# EasyEDA Pro project ProPrj_CraftVia-MakerCard-S-v1-Rev0_2026-09-30.epro, schematic MakerCard-S-Rev0

## Sheets
1 Core-G031: Board Name: Board1; Create Date: 2026-09-03; Page Name: P1; Project Name: CraftVia-Core-S-G031-v1-Rev0; Schematic Name: Schematic1; Update Date: 2026-09-03; Company: EasyEDA.com; Page Size: A3; Version: V1.0
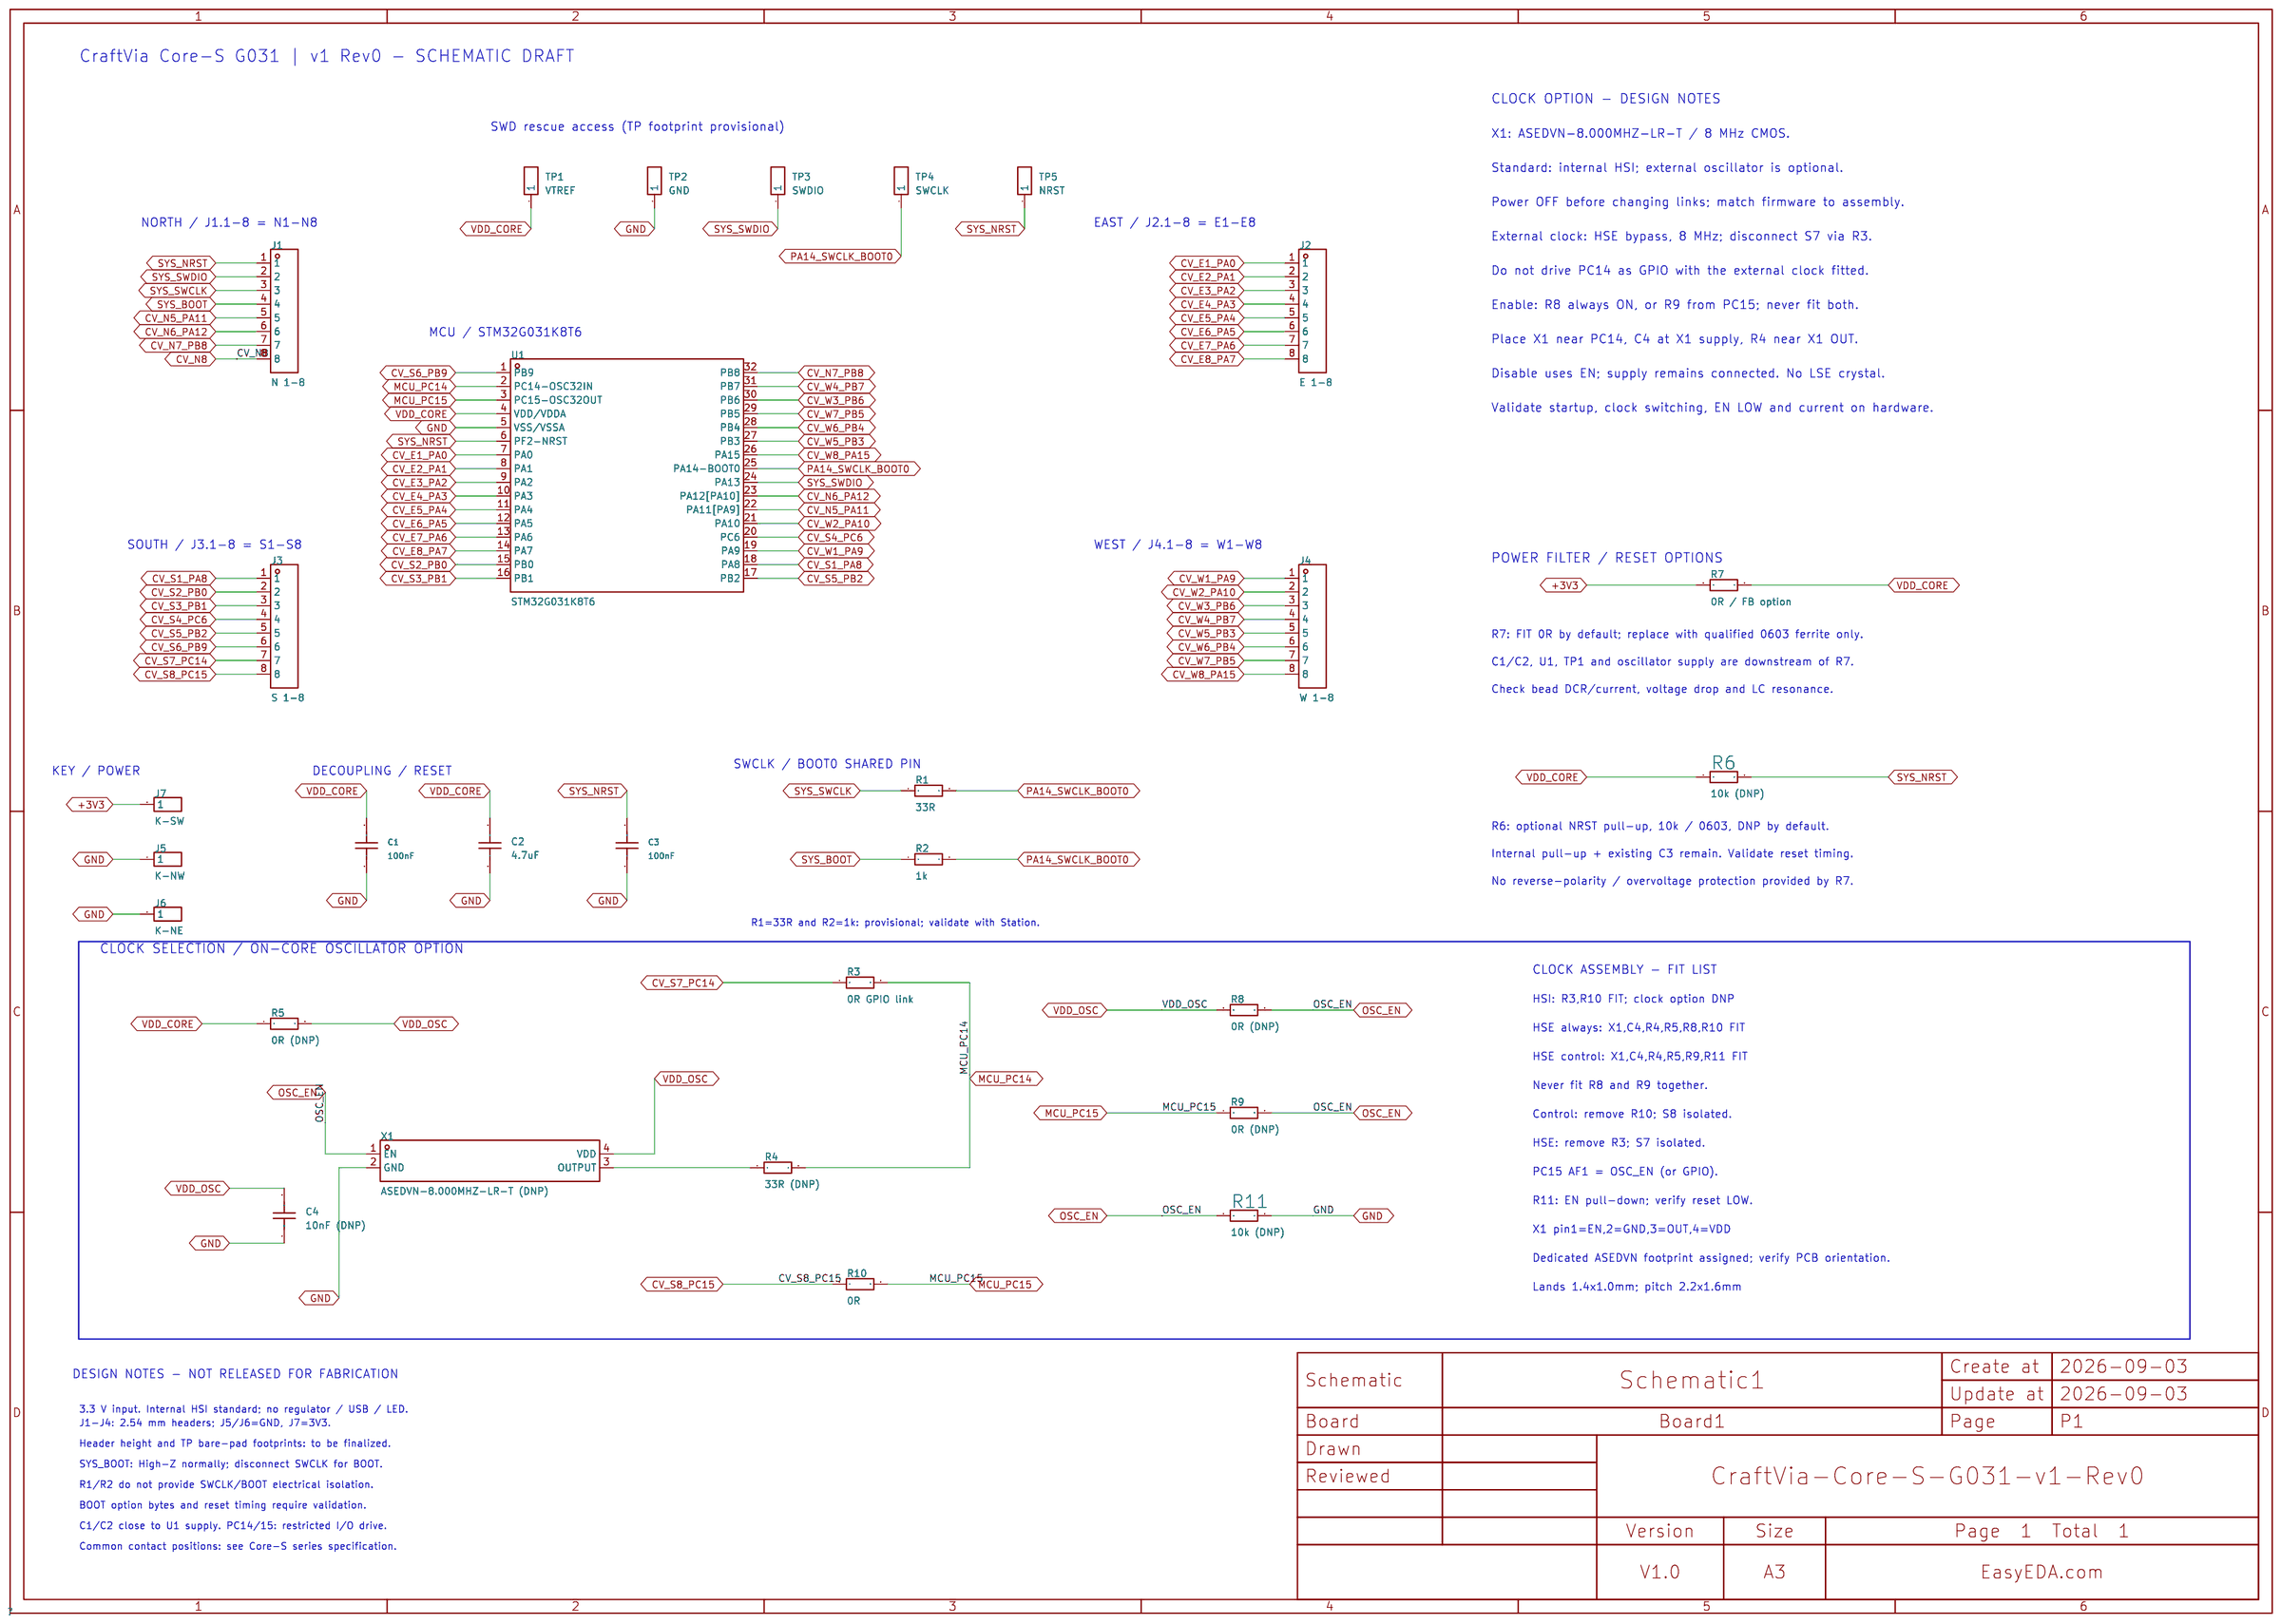
[diagram p0: Core-G031]
2 02_CORE_BREAKOUT: Create Date: 2026-09-22; Project Name: CraftVia-MakerCard-S-v1-Rev0; Schematic Name: MakerCard-S-Rev0; Update Date: 2026-09-22; Page Size: A4
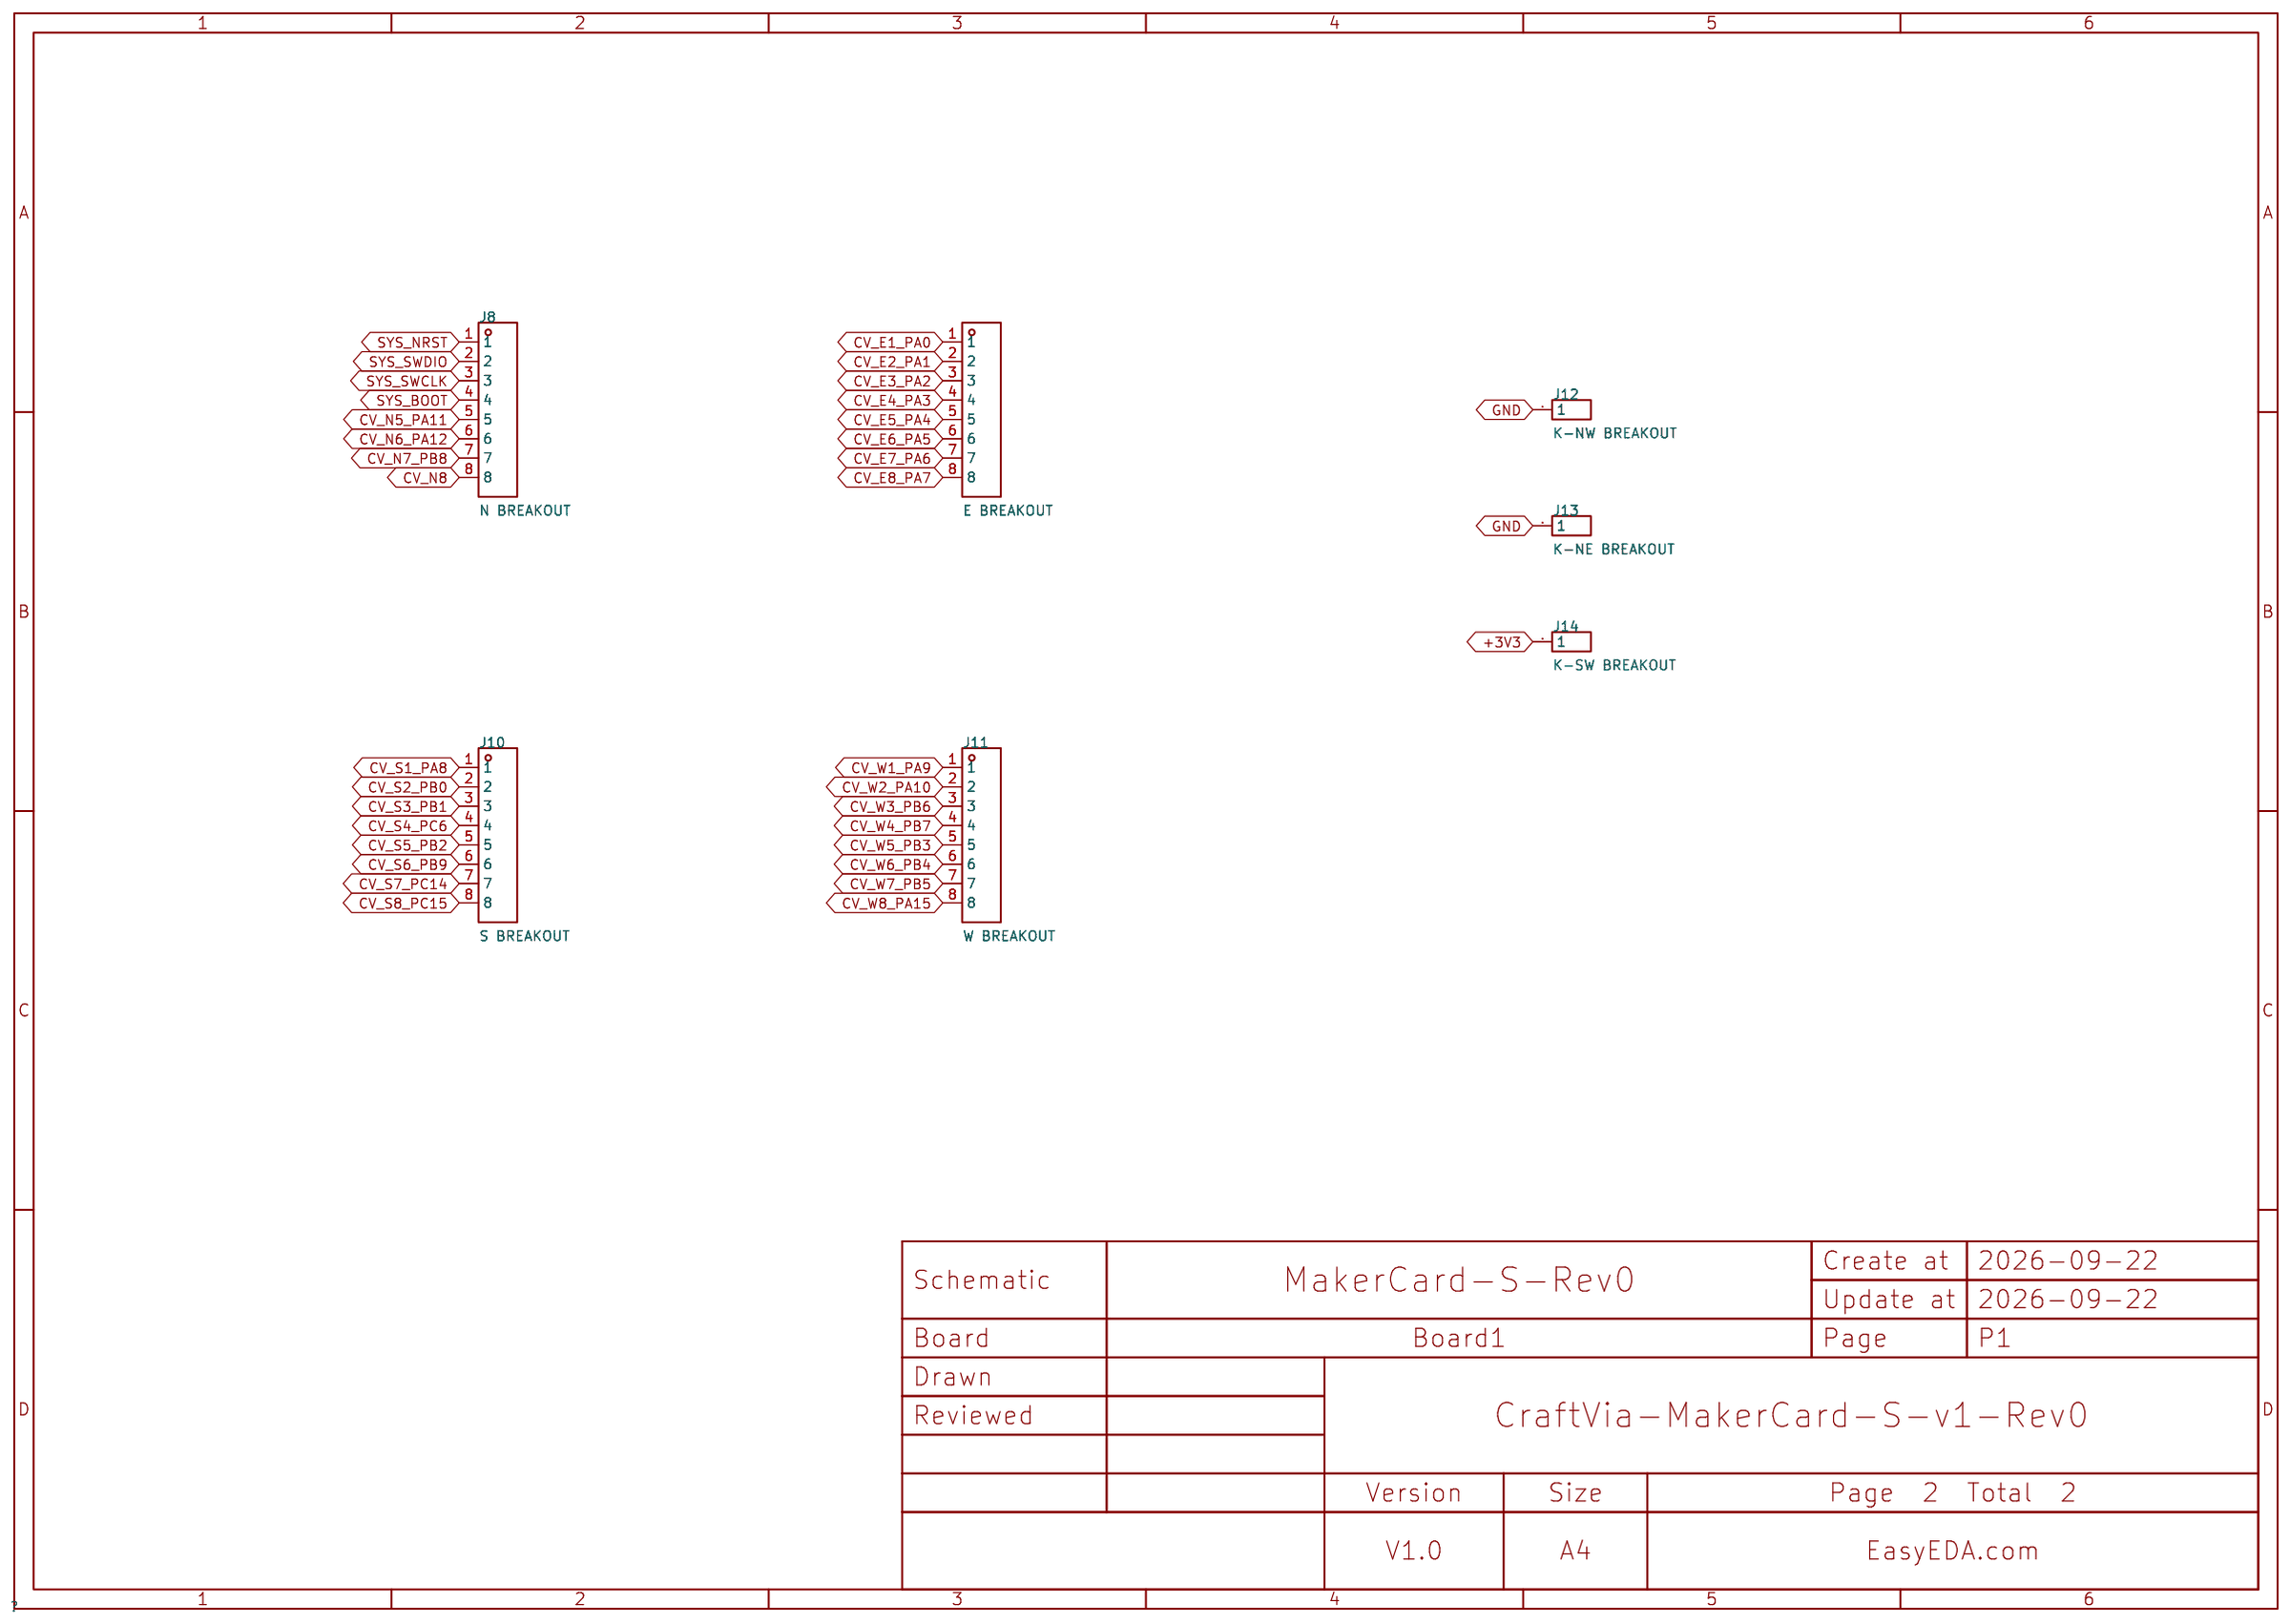
[diagram p1: 02_CORE_BREAKOUT]
3 03_PROTO_AREA: Create Date: 2026-09-22; Project Name: CraftVia-MakerCard-S-v1-Rev0; Schematic Name: MakerCard-S-Rev0; Update Date: 2026-09-22; Page Size: A4
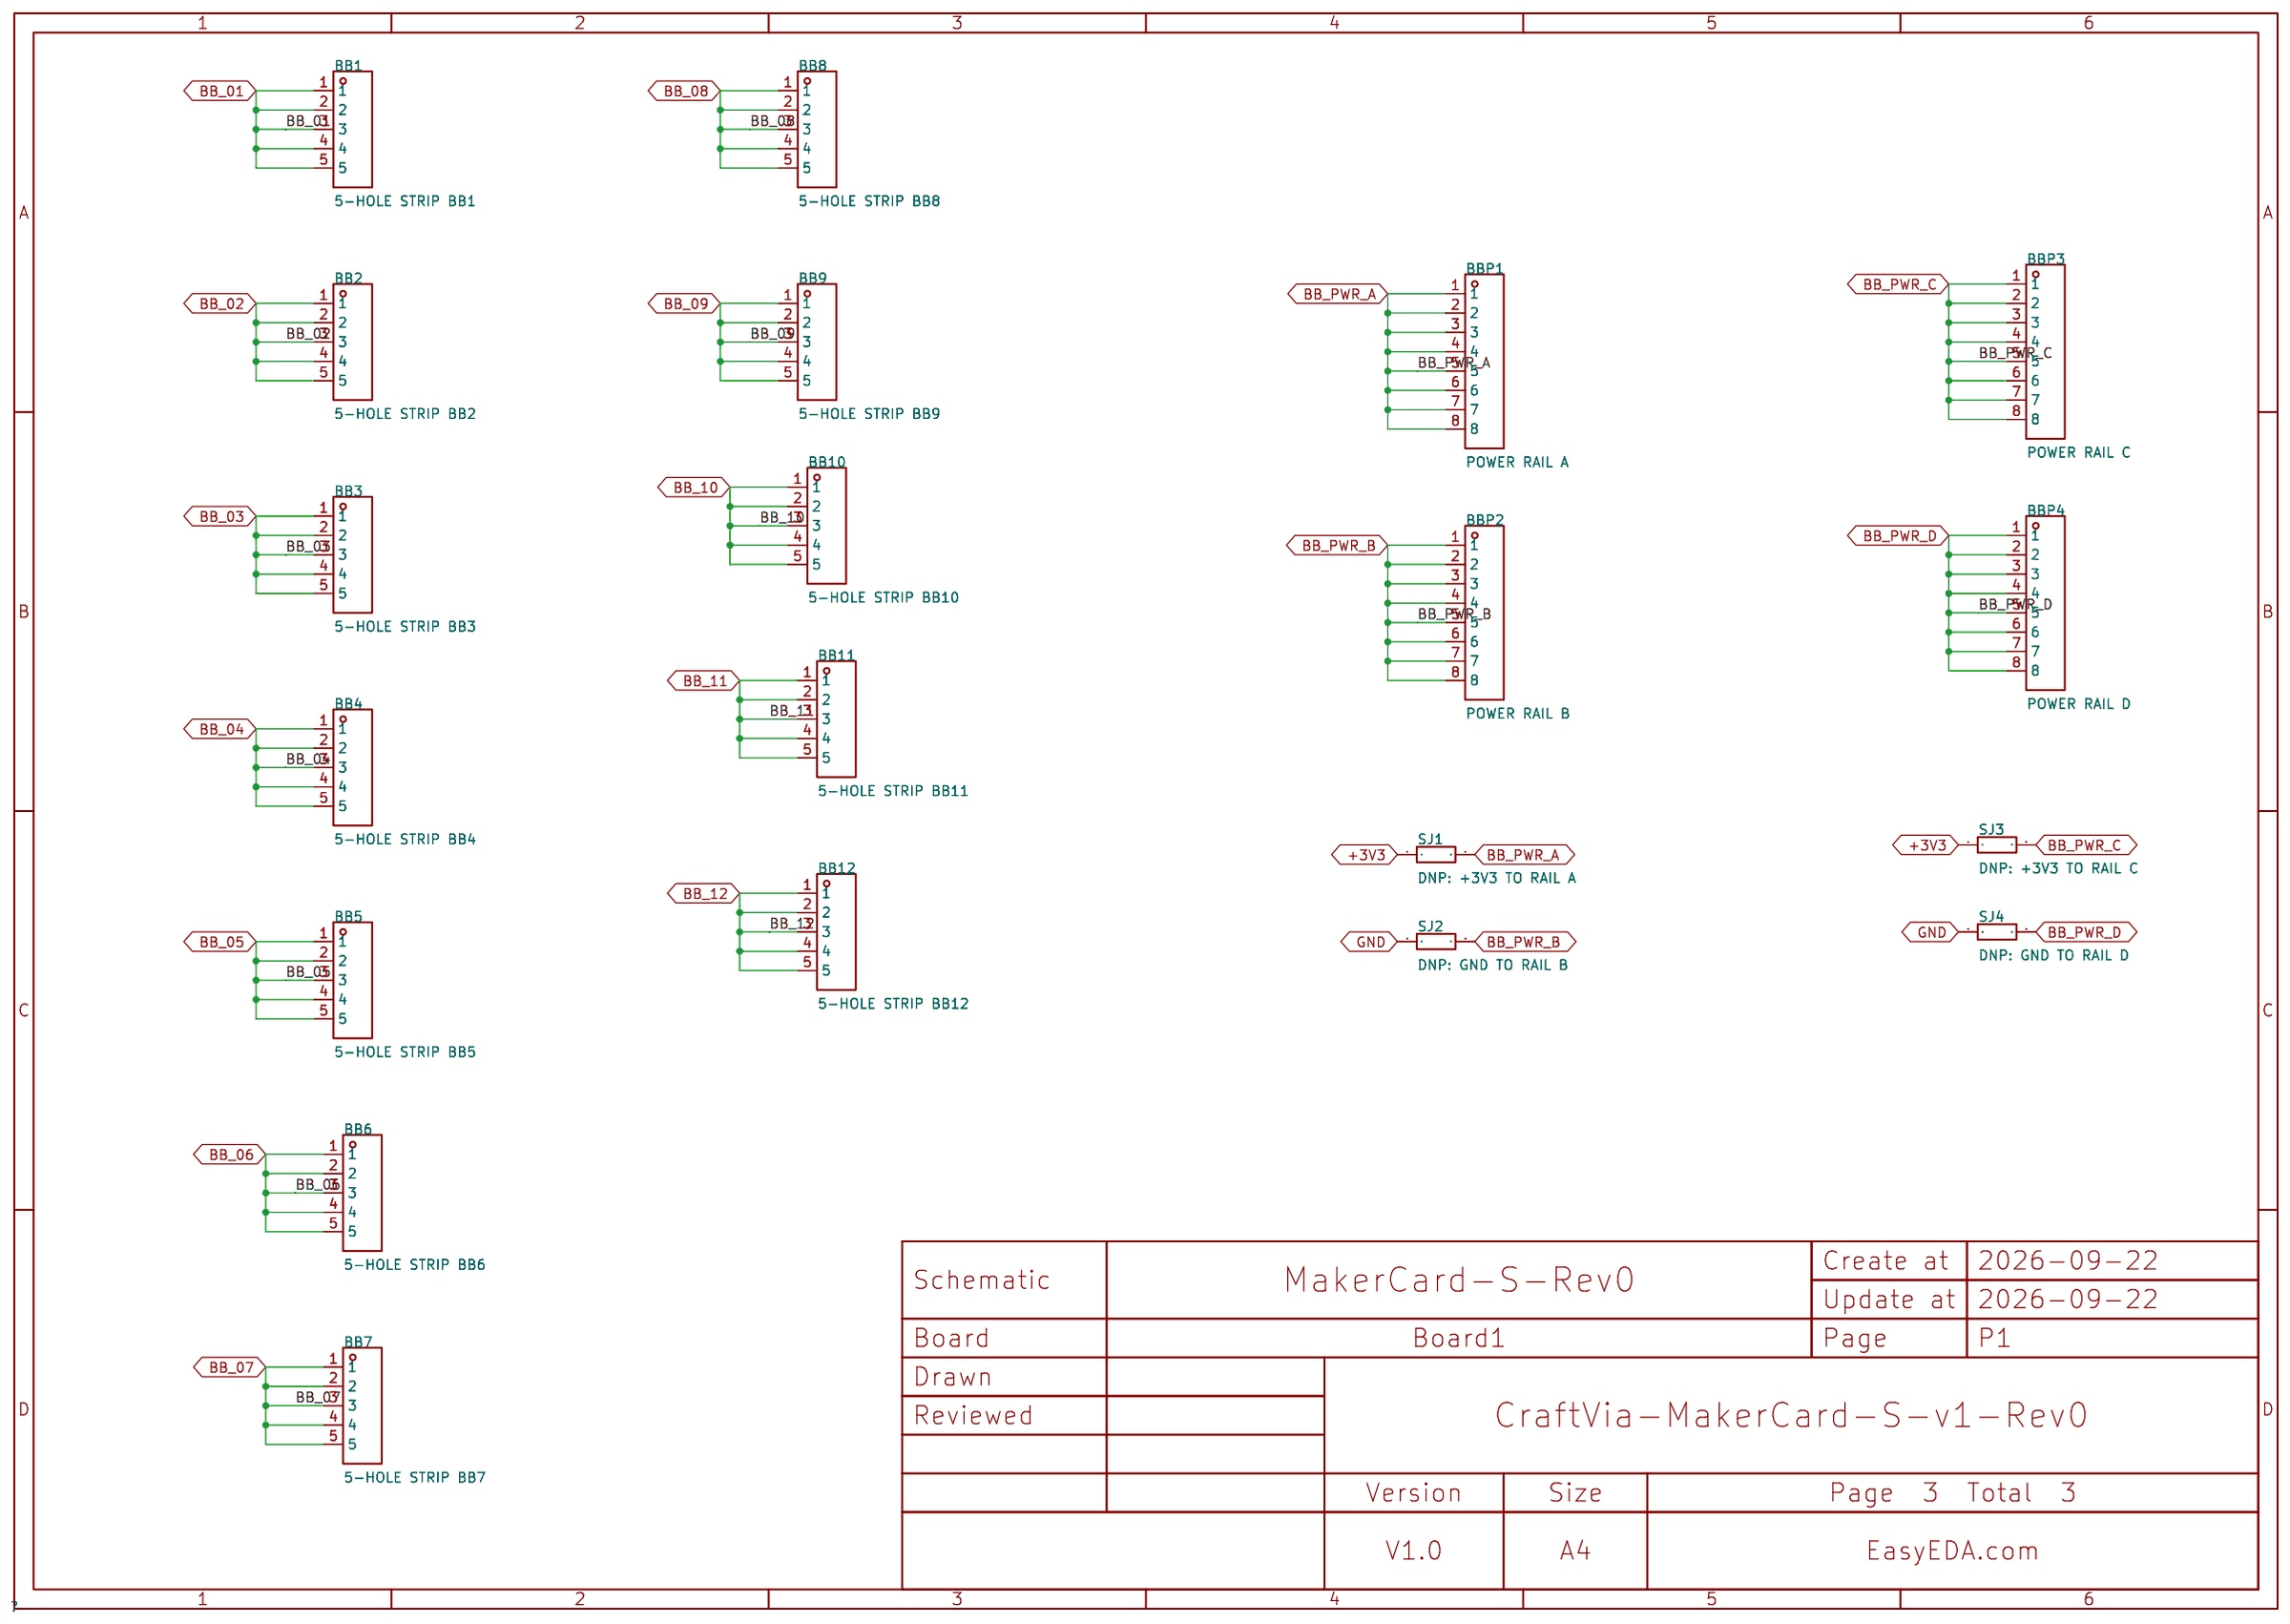
[diagram p2: 03_PROTO_AREA]

## Parts
sheet 02_CORE_BREAKOUT
J8  N BREAKOUT  [HDR-TH_8P-P2.54-V-M]  (no BOM)
J9  E BREAKOUT  [HDR-TH_8P-P2.54-V-M]  (no BOM)
J10  S BREAKOUT  [HDR-TH_8P-P2.54-V-M]  (no BOM)
J11  W BREAKOUT  [HDR-TH_8P-P2.54-V-M]  (no BOM)
J12  K-NW BREAKOUT  [HDR-TH_1P-P2.54-V-M]  (no BOM)
J13  K-NE BREAKOUT  [HDR-TH_1P-P2.54-V-M]  (no BOM)
J14  K-SW BREAKOUT  [HDR-TH_1P-P2.54-V-M]  (no BOM)
sheet 03_PROTO_AREA
BB1  5-HOLE STRIP BB1  [HDR-TH_5P-P2.54-V-M]  (no BOM)
BB2  5-HOLE STRIP BB2  [HDR-TH_5P-P2.54-V-M]  (no BOM)
BB3  5-HOLE STRIP BB3  [HDR-TH_5P-P2.54-V-M]  (no BOM)
BB4  5-HOLE STRIP BB4  [HDR-TH_5P-P2.54-V-M]  (no BOM)
BB5  5-HOLE STRIP BB5  [HDR-TH_5P-P2.54-V-M]  (no BOM)
BB6  5-HOLE STRIP BB6  [HDR-TH_5P-P2.54-V-M]  (no BOM)
BB7  5-HOLE STRIP BB7  [HDR-TH_5P-P2.54-V-M]  (no BOM)
BB8  5-HOLE STRIP BB8  [HDR-TH_5P-P2.54-V-M]  (no BOM)
BB9  5-HOLE STRIP BB9  [HDR-TH_5P-P2.54-V-M]  (no BOM)
BB10  5-HOLE STRIP BB10  [HDR-TH_5P-P2.54-V-M]  (no BOM)
BB11  5-HOLE STRIP BB11  [HDR-TH_5P-P2.54-V-M]  (no BOM)
BB12  5-HOLE STRIP BB12  [HDR-TH_5P-P2.54-V-M]  (no BOM)
BBP1  POWER RAIL A  [HDR-TH_8P-P2.54-V-M]  (no BOM)
BBP2  POWER RAIL B  [HDR-TH_8P-P2.54-V-M]  (no BOM)
BBP3  POWER RAIL C  [HDR-TH_8P-P2.54-V-M]  (no BOM)
BBP4  POWER RAIL D  [HDR-TH_8P-P2.54-V-M]  (no BOM)
SJ1  0Ω  [R0603]  (no BOM)
SJ2  0Ω  [R0603]  (no BOM)
SJ3  0Ω  [R0603]  (no BOM)
SJ4  0Ω  [R0603]  (no BOM)
sheet Core-G031
C1  100nF  [C0603]
C2  4.7uF  [C0603]
C3  100nF  [C0603]
C4  10nF  [C0603]  (no BOM)
J1  N 1-8  [HDR-TH_8P-P2.54-V-M]
J2  E 1-8  [HDR-TH_8P-P2.54-V-M]
J3  S 1-8  [HDR-TH_8P-P2.54-V-M]
J4  W 1-8  [HDR-TH_8P-P2.54-V-M]
J5  K-NW  [HDR-TH_1P-P2.54-V-M]
J6  K-NE  [HDR-TH_1P-P2.54-V-M]
J7  K-SW  [HDR-TH_1P-P2.54-V-M]
R1  33Ω  [R0603]
R2  1kΩ  [R0603]
R3  0Ω  [R0603]
R4  33Ω  [R0603]  (no BOM)
R5  0Ω  [R0603]  (no BOM)
R6  10kΩ  [R0603]  (no BOM)
R7  0Ω  [R0603]
R8  0Ω  [R0603]  (no BOM)
R9  0Ω  [R0603]  (no BOM)
R10  0Ω  [R0603]
R11  10kΩ  [R0603]  (no BOM)
TP1  VTREF  [HDR-TH_1P-P2.54-V-M]  (no BOM)
TP2  GND  [HDR-TH_1P-P2.54-V-M]  (no BOM)
TP3  SWDIO  [HDR-TH_1P-P2.54-V-M]  (no BOM)
TP4  SWCLK  [HDR-TH_1P-P2.54-V-M]  (no BOM)
TP5  NRST  [HDR-TH_1P-P2.54-V-M]  (no BOM)
U1  STM32G031K8T6  [LQFP-32_L7.0-W7.0-P0.80-LS9.0-BL]
X1  8MHz  [CraftVia_ASEDVN_3225_4P]  (no BOM)

## Library data of the parts
J8-J11 = 直排针2.54mm 1*8P: MakerCard-S external 2.54mm breakout; DNP; LCSC Part Name: 直排针 2.54mm 1*8P; Supplier Part: Header2.54mm 1*8P.1; Supplier Footprint: 插件; JLCPCB Part Class: Extended Part; Supplier: LCSC
J12-J14 = 2.54-1*1P针: MakerCard-S external 2.54mm breakout; DNP; LCSC Part Name: 1x1P 方针 直插; Supplier Part: Header-Male-2.54_1x1.1; Manufacturer: BOOMELE(博穆精密); Supplier Footprint: 插件,P=2.54mm; JLCPCB Part Class: Extended Part; Datasheet: https://item.szlcsc.com/datasheet/2.54-1*1P%25E9%2592%2588/82426.html; Supplier: LCSC; Pin Structure: 1x1P; Circluar Pins/Square Pins: Pin Header; Mounting Type: Through Hole; Number of Rows: 1; Number of Pins: 1P; Current Rating: 3A; Length of Mating Pin: 6mm; Insulation Height: 2.5mm; Length of End Connection Pin: 3mm; Contact Material: Brass; Contact Plating: Gold; Operating Temperature: -55℃~+105℃; Color: Black
BB1-BB12 = 2.54mm 1*5P 直排针: MakerCard-S breadboard-style five-hole connected strip; DNP; Supplier Part: 2.54mm 1*5P Header.1; JLCPCB Part Class: Extended Part; Supplier: LCSC
BBP1-BBP4 = 直排针2.54mm 1*8P: MakerCard-S configurable eight-hole breadboard power rail; DNP; LCSC Part Name: 直排针 2.54mm 1*8P; Supplier Part: Header2.54mm 1*8P.1; Supplier Footprint: 插件; JLCPCB Part Class: Extended Part; Supplier: LCSC
SJ1-SJ4 = 0603WAF0000T5E: Optional 0603 solder bridge / 0R link; DNP; LCSC Part Name: 厚膜电阻 0Ω ±1%; Supplier Part: 0603WAF0000T5E.1; Manufacturer: UNI-ROYAL(厚声); Supplier Footprint: 0603; JLCPCB Part Class: Basic Part; Datasheet: https://item.szlcsc.com/datasheet/0603WAF0000T5E/21903.html; Supplier: LCSC; Type: Thick Film Resistor; Tolerance: ±1%; Power(Watts): 100mW; Voltage-Supply(Max): 75V; Operating Temperature: -55℃~+155℃
C1 C3 = CC0603KRX7R9BB104: Capacitance:100nF Tolerance:±10% Tolerance:±10% Voltage Rating:50V Temperature Coefficient:X7R; LCSC Part Name: 100nF ±10% 50V; Supplier Part: C14663; Manufacturer: YAGEO(国巨); Supplier Footprint: 0603; JLCPCB Part Class: Basic Part; Datasheet: https://item.szlcsc.com/datasheet/CC0603KRX7R9BB104/15331.html; Supplier: LCSC; Tolerance: ±10%; Voltage Rating: 50V; Temperature Coefficient: X7R
C2 = CL10A475KO8NNNC: Capacitance:4.7uF Tolerance:±10% Tolerance:±10% Voltage Rating:16V Temperature Coefficient:X5R; LCSC Part Name: 4.7uF ±10% 16V; Supplier Part: C19666; Manufacturer: SAMSUNG(三星); Supplier Footprint: 0603; JLCPCB Part Class: Basic Part; Datasheet: https://item.szlcsc.com/datasheet/CL10A475KO8NNNC/20375.html; Supplier: LCSC; Tolerance: ±10%; Voltage Rating: 16V; Temperature Coefficient: X5R
C4 = 0603B103K500NT: Capacitance:10nF Tolerance:±10% Tolerance:±10% Voltage Rating:50V Temperature Coefficient:X7R; LCSC Part Name: 10nF ±10% 50V; Supplier Part: C57112; Manufacturer: FH(风华); Supplier Footprint: 0603; JLCPCB Part Class: Basic Part; Datasheet: https://item.szlcsc.com/datasheet/0603B103K500NT/58143.html; Supplier: LCSC; Tolerance: ±10%; Voltage Rating: 50V; Temperature Coefficient: X7R
J1-J4 = 直排针2.54mm 1*8P: Circluar Pins/Square Pins:- Current Rating (Max):- Voltage Rating (Max):- Length of Mating Pin:- Insulation Height:- Contact Material:; LCSC Part Name: 直排针 2.54mm 1*8P; Supplier Part: C49256; Supplier Footprint: 插件; JLCPCB Part Class: Extended Part; Supplier: LCSC
J5-J7 TP1-TP5 = 2.54-1*1P针: Pin Structure:1x1P Pitch:- Row Spacing:- Circluar Pins/Square Pins:Pin Header Mounting Type:Through Hole Number of Rows:1 Number of Pins:1P Current Rating:3A Voltage Rating (Max):- Length of Mating Pin:6mm Insulation Height:2.5mm Length of End Connection; LCSC Part Name: 1x1P 方针 直插; Supplier Part: C81276; Manufacturer: BOOMELE(博穆精密); Supplier Footprint: 插件,P=2.54mm; JLCPCB Part Class: Extended Part; Datasheet: https://item.szlcsc.com/datasheet/2.54-1*1P%25E9%2592%2588/82426.html; Supplier: LCSC; Pin Structure: 1x1P; Circluar Pins/Square Pins: Pin Header; Mounting Type: Through Hole; Number of Rows: 1; Number of Pins: 1P; Current Rating: 3A; Length of Mating Pin: 6mm; Insulation Height: 2.5mm; Length of End Connection Pin: 3mm; Contact Material: Brass; Contact Plating: Gold; Operating Temperature: -55℃~+105℃; Color: Black
R1 R4 = 0603WAF330JT5E: Type:Thick Film Resistor Resistance:33Ω Tolerance:±1% Tolerance:±1% Power(Watts):100mW Voltage-Supply(Max):75V Temperature Coefficient:±100ppm/℃ Temperature Coefficient:±100ppm/℃ Operating Temperature:-55℃~+155℃ Operating Temperature:-55℃~+155℃; LCSC Part Name: 33Ω ±1% 100mW 厚膜电阻; Supplier Part: C23140; Manufacturer: UNI-ROYAL(厚声); Supplier Footprint: 0603; JLCPCB Part Class: Basic Part; Datasheet: https://item.szlcsc.com/datasheet/0603WAF330JT5E/23867.html; Supplier: LCSC; Type: Thick Film Resistor; Tolerance: ±1%; Power(Watts): 100mW; Voltage-Supply(Max): 75V; Temperature Coefficient: ±100ppm/℃; Operating Temperature: -55℃~+155℃
R2 = 0603WAF1001T5E: Type:Thick Film Resistor Resistance:1kΩ Tolerance:±1% Tolerance:±1% Power(Watts):100mW Voltage-Supply(Max):75V Temperature Coefficient:±100ppm/℃ Temperature Coefficient:±100ppm/℃ Operating Temperature:-55℃~+155℃ Operating Temperature:-55℃~+155℃; LCSC Part Name: 1kΩ ±1% 100mW 厚膜电阻; Supplier Part: C21190; Manufacturer: UNI-ROYAL(厚声); Supplier Footprint: 0603; JLCPCB Part Class: Basic Part; Datasheet: https://item.szlcsc.com/datasheet/0603WAF1001T5E/21904.html; Supplier: LCSC; Type: Thick Film Resistor; Tolerance: ±1%; Power(Watts): 100mW; Voltage-Supply(Max): 75V; Temperature Coefficient: ±100ppm/℃; Operating Temperature: -55℃~+155℃
R3 R5 R7-R10 = 0603WAF0000T5E: Type:Thick Film Resistor Resistance:0Ω Tolerance:±1% Tolerance:±1% Power(Watts):100mW Voltage-Supply(Max):75V Temperature Coefficient:- Temperature Coefficient:- Operating Temperature:-55℃~+155℃ Operating Temperature:-55℃~+155℃; LCSC Part Name: 厚膜电阻 0Ω ±1%; Supplier Part: C21189; Manufacturer: UNI-ROYAL(厚声); Supplier Footprint: 0603; JLCPCB Part Class: Basic Part; Datasheet: https://item.szlcsc.com/datasheet/0603WAF0000T5E/21903.html; Supplier: LCSC; Type: Thick Film Resistor; Tolerance: ±1%; Power(Watts): 100mW; Voltage-Supply(Max): 75V; Operating Temperature: -55℃~+155℃
R6 R11 = 0603WAF1002T5E: Type:Thick Film Resistor Resistance:10kΩ Tolerance:±1% Tolerance:±1% Power(Watts):100mW Voltage-Supply(Max):75V Temperature Coefficient:±100ppm/℃ Temperature Coefficient:±100ppm/℃ Operating Temperature:-55℃~+155℃ Operating Temperature:-55℃~+155℃; LCSC Part Name: 厚膜电阻 10kΩ ±1% 100mW; Supplier Part: C25804; Manufacturer: UNI-ROYAL(厚声); Supplier Footprint: 0603; JLCPCB Part Class: Basic Part; Datasheet: https://item.szlcsc.com/datasheet/0603WAF1002T5E/26547.html; Supplier: LCSC; Type: Thick Film Resistor; Tolerance: ±1%; Power(Watts): 100mW; Voltage-Supply(Max): 75V; Temperature Coefficient: ±100ppm/℃; Operating Temperature: -55℃~+155℃
U1 = STM32G031K8T6: CPU Core:ARM Cortex-M0+ CPU Maximum Speed:64MHz Core Size:32 Bit Program Storage Size:64KB Program Memory Type:FLASH RAM Size:8KB EEPROM:- Number of I/O:30 ADC (Bit):12bit Oscillator Type:Built-in+External Voltage - Supply:1.7V~3.6V Voltage - Supply:1.7V~; LCSC Part Name: 主流Arm Cortex-M0+ MCU，具有64 KB Flash存储器、8 KB RAM、64 MHz CPU、2x USART、定时器、ADC和通信接口，1.7-3.6V; Supplier Part: C432203; Manufacturer: ST(意法半导体); Supplier Footprint: LQFP-32(7x7); JLCPCB Part Class: Extended Part; Datasheet: https://item.szlcsc.com/datasheet/STM32G031K8T6/428991.html; Supplier: LCSC; CPU Core: ARM Cortex-M0+; CPU Maximum Speed: 64MHz; Core Size: 32 Bit; Program Storage Size: 64KB; Program Memory Type: FLASH; RAM Size: 8KB; Number of I/O: 30; ADC (Bit): 12bit; Oscillator Type: Built-in+External; Voltage - Supply: 1.7V~3.6V; Operating Temperature: -40℃~+85℃
X1 = ASEDVN-8.000MHZ-LR-T: Dedicated ASEDVN recommended land: 1.4x1.0mm; pitch 2.2x1.6mm. 1=EN,2=GND,3=OUT,4=VDD. No 3D model.; Manufacturer: Abracon; Supplier: DigiKey; Supplier Part: 535-ASEDVN-8.000MHZ-LR-TCT-ND; Datasheet: https://abracon.com/datasheets/ASEDVN.pdf; Voltage - Supply: 1.6V to 3.63V; Operating Temperature: -40C to +85C; Frequency Stability: 25ppm

## Nets
+3V3: J7.1 J14.1 R7.1 SJ1.1 SJ3.1
GND: C1.1 C2.1 C3.1 C4.1 J5.1 J6.1 J12.1 J13.1 R11.2 SJ2.1 SJ4.1 TP2.1 U1.5(VSS/VSSA) X1.2(GND)
VDD_CORE: C1.2 C2.2 R5.1 R6.1 R7.2 TP1.1 U1.4(VDD/VDDA)
VDD_OSC: C4.2 R5.2 R8.1 X1.4(VDD)
BB_01: BB1.1 BB1.2 BB1.3 BB1.4 BB1.5
BB_02: BB2.1 BB2.2 BB2.3 BB2.4 BB2.5
BB_03: BB3.1 BB3.2 BB3.3 BB3.4 BB3.5
BB_04: BB4.1 BB4.2 BB4.3 BB4.4 BB4.5
BB_05: BB5.1 BB5.2 BB5.3 BB5.4 BB5.5
BB_06: BB6.1 BB6.2 BB6.3 BB6.4 BB6.5
BB_07: BB7.1 BB7.2 BB7.3 BB7.4 BB7.5
BB_08: BB8.1 BB8.2 BB8.3 BB8.4 BB8.5
BB_09: BB9.1 BB9.2 BB9.3 BB9.4 BB9.5
BB_10: BB10.1 BB10.2 BB10.3 BB10.4 BB10.5
BB_11: BB11.1 BB11.2 BB11.3 BB11.4 BB11.5
BB_12: BB12.1 BB12.2 BB12.3 BB12.4 BB12.5
BB_PWR_A: BBP1.1 BBP1.2 BBP1.3 BBP1.4 BBP1.5 BBP1.6 BBP1.7 BBP1.8 SJ1.2
BB_PWR_B: BBP2.1 BBP2.2 BBP2.3 BBP2.4 BBP2.5 BBP2.6 BBP2.7 BBP2.8 SJ2.2
BB_PWR_C: BBP3.1 BBP3.2 BBP3.3 BBP3.4 BBP3.5 BBP3.6 BBP3.7 BBP3.8 SJ3.2
BB_PWR_D: BBP4.1 BBP4.2 BBP4.3 BBP4.4 BBP4.5 BBP4.6 BBP4.7 BBP4.8 SJ4.2
CV_E1_PA0: J2.1 J9.1 U1.7(PA0)
CV_E2_PA1: J2.2 J9.2 U1.8(PA1)
CV_E3_PA2: J2.3 J9.3 U1.9(PA2)
CV_E4_PA3: J2.4 J9.4 U1.10(PA3)
CV_E5_PA4: J2.5 J9.5 U1.11(PA4)
CV_E6_PA5: J2.6 J9.6 U1.12(PA5)
CV_E7_PA6: J2.7 J9.7 U1.13(PA6)
CV_E8_PA7: J2.8 J9.8 U1.14(PA7)
CV_N5_PA11: J1.5 J8.5 U1.22(PA11[PA9])
CV_N6_PA12: J1.6 J8.6 U1.23(PA12[PA10])
CV_N7_PB8: J1.7 J8.7 U1.32(PB8)
CV_N8: J1.8 J8.8
CV_S1_PA8: J3.1 J10.1 U1.18(PA8)
CV_S2_PB0: J3.2 J10.2 U1.15(PB0)
CV_S3_PB1: J3.3 J10.3 U1.16(PB1)
CV_S4_PC6: J3.4 J10.4 U1.20(PC6)
CV_S5_PB2: J3.5 J10.5 U1.17(PB2)
CV_S6_PB9: J3.6 J10.6 U1.1(PB9)
CV_S7_PC14: J3.7 J10.7 R3.1
CV_S8_PC15: J3.8 J10.8 R10.1
CV_W1_PA9: J4.1 J11.1 U1.19(PA9)
CV_W2_PA10: J4.2 J11.2 U1.21(PA10)
CV_W3_PB6: J4.3 J11.3 U1.30(PB6)
CV_W4_PB7: J4.4 J11.4 U1.31(PB7)
CV_W5_PB3: J4.5 J11.5 U1.27(PB3)
CV_W6_PB4: J4.6 J11.6 U1.28(PB4)
CV_W7_PB5: J4.7 J11.7 U1.29(PB5)
CV_W8_PA15: J4.8 J11.8 U1.26(PA15)
MCU_PC14: R3.2 R4.2 U1.2(PC14-OSC32IN)
MCU_PC15: R9.1 R10.2 U1.3(PC15-OSC32OUT)
OSC_EN: R8.2 R9.2 R11.1 X1.1(EN)
OSC_OUT: R4.1 X1.3(OUTPUT)
PA14_SWCLK_BOOT0: R1.2 R2.2 TP4.1 U1.25(PA14-BOOT0)
SYS_BOOT: J1.4 J8.4 R2.1
SYS_NRST: C3.2 J1.1 J8.1 R6.2 TP5.1 U1.6(PF2-NRST)
SYS_SWCLK: J1.3 J8.3 R1.1
SYS_SWDIO: J1.2 J8.2 TP3.1 U1.24(PA13)

## Notes on the sheets
sheet 1
- CraftVia Core-S G031 | v1 Rev0 - SCHEMATIC DRAFT
- CLOCK OPTION - DESIGN NOTES
- SWD rescue access (TP footprint provisional)
- X1: ASEDVN-8.000MHZ-LR-T / 8 MHz CMOS.
- Standard: internal HSI; external oscillator is optional.
- Power OFF before changing links; match firmware to assembly.
- NORTH / J1.1-8 = N1-N8
- EAST / J2.1-8 = E1-E8
- External clock: HSE bypass, 8 MHz; disconnect S7 via R3.
- Do not drive PC14 as GPIO with the external clock fitted.
- Enable: R8 always ON, or R9 from PC15; never fit both.
- MCU / STM32G031K8T6
- Place X1 near PC14, C4 at X1 supply, R4 near X1 OUT.
- Disable uses EN; supply remains connected. No LSE crystal.
- Validate startup, clock switching, EN LOW and current on hardware.
- SOUTH / J3.1-8 = S1-S8
- WEST / J4.1-8 = W1-W8
- POWER FILTER / RESET OPTIONS
- R7: FIT 0R by default; replace with qualified 0603 ferrite only.
- C1/C2, U1, TP1 and oscillator supply are downstream of R7.
- Check bead DCR/current, voltage drop and LC resonance.
- KEY / POWER
- DECOUPLING / RESET
- SWCLK / BOOT0 SHARED PIN
- R6: optional NRST pull-up, 10k / 0603, DNP by default.
- Internal pull-up + existing C3 remain. Validate reset timing.
- No reverse-polarity / overvoltage protection provided by R7.
- R1=33R and R2=1k: provisional; validate with Station.
- CLOCK SELECTION / ON-CORE OSCILLATOR OPTION
- CLOCK ASSEMBLY - FIT LIST
- HSI: R3,R10 FIT; clock option DNP
- HSE always: X1,C4,R4,R5,R8,R10 FIT
- HSE control: X1,C4,R4,R5,R9,R11 FIT
- Never fit R8 and R9 together.
- Control: remove R10; S8 isolated.
- HSE: remove R3; S7 isolated.
- PC15 AF1 = OSC_EN (or GPIO).
- R11: EN pull-down; verify reset LOW.
- X1 pin1=EN,2=GND,3=OUT,4=VDD
- Dedicated ASEDVN footprint assigned; verify PCB orientation.
- Lands 1.4x1.0mm; pitch 2.2x1.6mm
- DESIGN NOTES - NOT RELEASED FOR FABRICATION
- 3.3 V input. Internal HSI standard; no regulator / USB / LED.
- J1-J4: 2.54 mm headers; J5/J6=GND, J7=3V3.
- Header height and TP bare-pad footprints: to be finalized.
- SYS_BOOT: High-Z normally; disconnect SWCLK for BOOT.
- R1/R2 do not provide SWCLK/BOOT electrical isolation.
- BOOT option bytes and reset timing require validation.
- C1/C2 close to U1 supply. PC14/15: restricted I/O drive.
- Common contact positions: see Core-S series specification.
